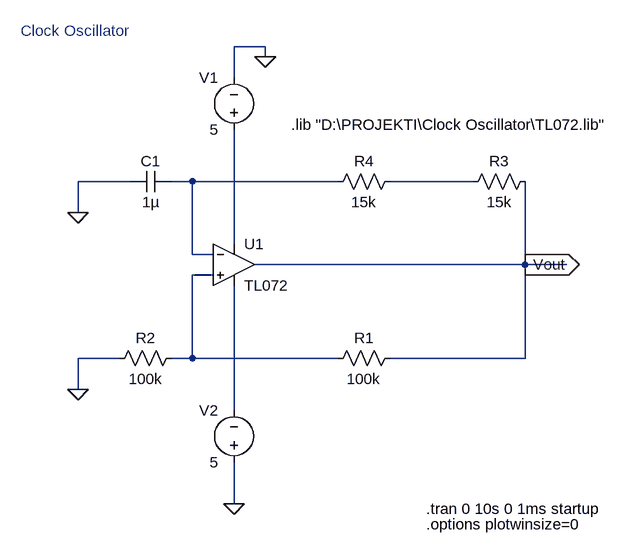
[diagram p0: schematic ClockOscilator.asc]
ClockOscilator.asc, the LTspice schematic file:
Version 4.1
SHEET 1 1392 680
WIRE 224 -160 176 -160
WIRE 224 -144 224 -160
WIRE 176 -112 176 -160
WIRE 16 48 -64 48
WIRE 112 48 80 48
WIRE 336 48 112 48
WIRE 544 48 416 48
WIRE -64 96 -64 48
WIRE 176 144 176 -32
WIRE 112 160 112 48
WIRE 144 160 112 160
WIRE 624 176 624 48
WIRE 624 176 208 176
WIRE 688 176 624 176
WIRE 144 192 112 192
WIRE 0 320 -64 320
WIRE 112 320 112 192
WIRE 112 320 80 320
WIRE 336 320 112 320
WIRE 624 320 624 176
WIRE 624 320 416 320
WIRE -64 368 -64 320
WIRE 176 400 176 208
WIRE 176 544 176 480
FLAG -64 96 0
FLAG -64 368 0
FLAG 624 176 Vout
IOPIN 624 176 Out
FLAG 224 -144 0
FLAG 176 544 0
SYMBOL res 432 304 R90
WINDOW 0 0 56 VBottom 2
WINDOW 3 32 56 VTop 2
SYMATTR InstName R1
SYMATTR Value 100k
SYMBOL res 96 304 R90
WINDOW 0 0 56 VBottom 2
WINDOW 3 32 56 VTop 2
SYMATTR InstName R2
SYMATTR Value 100k
SYMBOL cap 80 32 R90
WINDOW 0 0 32 VBottom 2
WINDOW 3 32 32 VTop 2
SYMATTR InstName C1
SYMATTR Value 1µ
SYMBOL res 640 32 R90
WINDOW 0 0 56 VBottom 2
WINDOW 3 32 56 VTop 2
SYMATTR InstName R3
SYMATTR Value 15k
SYMBOL res 432 32 R90
WINDOW 0 0 56 VBottom 2
WINDOW 3 32 56 VTop 2
SYMATTR InstName R4
SYMATTR Value 15k
SYMBOL voltage 176 -16 R180
WINDOW 0 24 96 Left 2
WINDOW 3 24 16 Left 2
WINDOW 123 0 0 Left 0
WINDOW 39 0 0 Left 0
SYMATTR InstName V1
SYMATTR Value 5
SYMBOL voltage 176 496 R180
WINDOW 0 24 96 Left 2
WINDOW 3 24 16 Left 2
WINDOW 123 0 0 Left 0
WINDOW 39 0 0 Left 0
SYMATTR InstName V2
SYMATTR Value 5
SYMBOL OpAmps\\opamp2 176 112 R0
SYMATTR InstName U1
SYMATTR Value TL072
TEXT 472 552 Left 2 !.tran 0 10s 0 1ms startup
TEXT -152 -184 Left 2 ;Clock Oscillator
TEXT 264 -40 Left 2 !.lib "D:\\PROJEKTI\\Clock Oscillator\\TL072.lib"
TEXT 472 576 Left 2 !.options plotwinsize=0

The netlist it stands for:
* ClockOscilator.asc
R1 Vout N004 100k
R2 N004 0 100k
C1 N001 0 1µ
R3 Vout N002 15k
R4 N002 N001 15k
V1 N003 0 5
V2 0 N005 5
X§U1 N004 N001 N003 N005 Vout TL072  ; pins In+ In- V+ V- OUT
.tran 0 10s 0 1ms startup
* Clock Oscillator
.lib "D:\PROJEKTI\Clock Oscillator\TL072.lib"
.options plotwinsize=0
.backanno
.end